# EAGLE design weather baloon_tx (EAGLE 9.2.0)
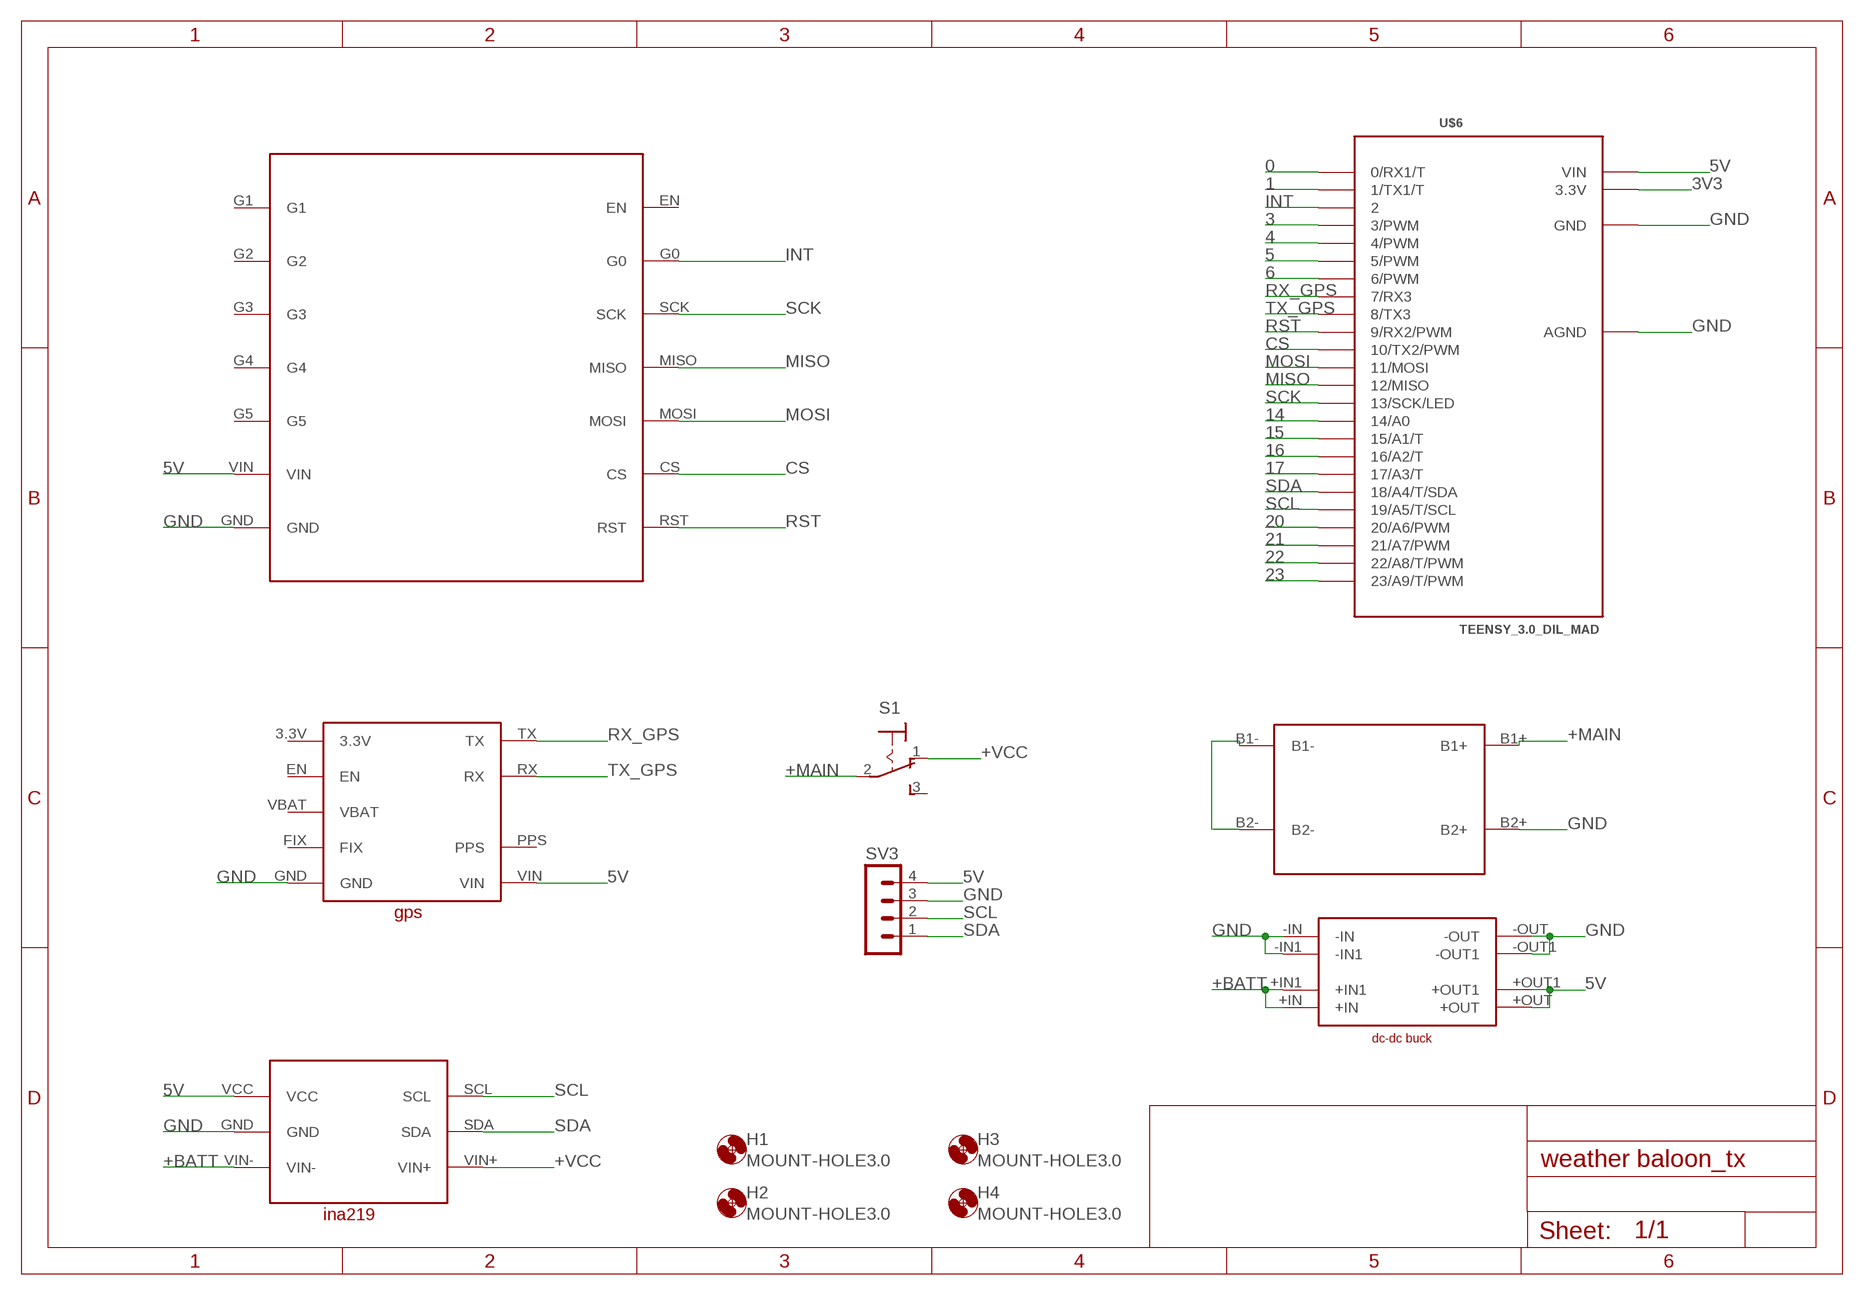
[diagram p0: schematic, sheet 1]

## Parts
H1  MOUNT-HOLE3.0  [3,0]
H2  MOUNT-HOLE3.0  [3,0]
H3  MOUNT-HOLE3.0  [3,0]
H4  MOUNT-HOLE3.0  [3,0]
S1  320-916  [320-916]
SV3  MA04-1  [MA04-1]
U$1  RFM96_MAD  [RFM96]
U$2  DC-DC_BUCK_MAD  [DC-DC_BUCK]
U$3  GPS_MAD  [GPS]
U$4  18650-2  [18650-2]
U$5  INA219_MAD  [INA219]
U$6  TEENSY_3.0_DIL_MAD  [TEENSY_3.0_DIL_MAD]

## Nets
0: U$6.0(0/RX1/T)
1: U$6.1(1/TX1/T)
3: U$6.3(3/PWM)
3V3: U$6.3.3V
4: U$6.4(4/PWM)
5: U$6.5(5/PWM)
5V: SV3.4 U$1.VIN U$2.+OUT U$2.+OUT1 U$3.VIN U$5.VCC U$6.VIN
6: U$6.6(6/PWM)
14: U$6.14/A0
15: U$6.15/A1(15/A1/T)
16: U$6.16/A2(16/A2/T)
17: U$6.17/A3(17/A3/T)
20: U$6.20/A6(20/A6/PWM)
21: U$6.21/A7(21/A7/PWM)
22: U$6.22/A8(22/A8/T/PWM)
23: U$6.23/A9(23/A9/T/PWM)
+BATT: U$2.+IN U$2.+IN1 U$5.VIN-
+MAIN: S1.2(P) U$4.B1+
+VCC: S1.1(O) U$5.VIN+
CS: U$1.CS U$6.10(10/TX2/PWM)
GND: SV3.3 U$1.GND U$2.-IN U$2.-IN1 U$2.-OUT U$2.-OUT1 U$3.GND U$4.B2+ U$5.GND U$6.AGND U$6.GND
INT: U$1.G0 U$6.2
MISO: U$1.MISO U$6.12(12/MISO)
MOSI: U$1.MOSI U$6.11(11/MOSI)
N$3: U$4.B1- U$4.B2-
RST: U$1.RST U$6.9(9/RX2/PWM)
RX_GPS: U$3.TX U$6.7(7/RX3)
SCK: U$1.SCK U$6.13(13/SCK/LED)
SCL: SV3.2 U$5.SCL U$6.19/A5(19/A5/T/SCL)
SDA: SV3.1 U$5.SDA U$6.18/A4(18/A4/T/SDA)
TX_GPS: U$3.RX U$6.8(8/TX3)
Unconnected: S1.3(S) U$1.EN U$1.G1 U$1.G2 U$1.G3 U$1.G4 U$1.G5 U$3.3.3V U$3.EN U$3.FIX U$3.PPS U$3.VBAT

## Library data of the parts
H1-H4 = holes:MOUNT-HOLE: MOUNTING HOLE with drill center marker
S1 = switch:320-916: TOGGLE SWITCH distributor RS Components
SV3 = con-lstb:MA04-1: PIN HEADER; OC_FARNELL: unknown; OC_NEWARK: unknown
U$1 = rfm95_mad:RFM96_MAD: rfm96_mad
U$2 = dc-dc_mad:DC-DC_BUCK_MAD
U$3 = gps_mad:GPS_MAD
U$4 = 18650 holder-3:18650-2
U$5 = ina219_mad:INA219_MAD
U$6 = Teensy_3_and_LC_Series_Boards_v1.4:TEENSY_3.0_DIL_MAD

## Board
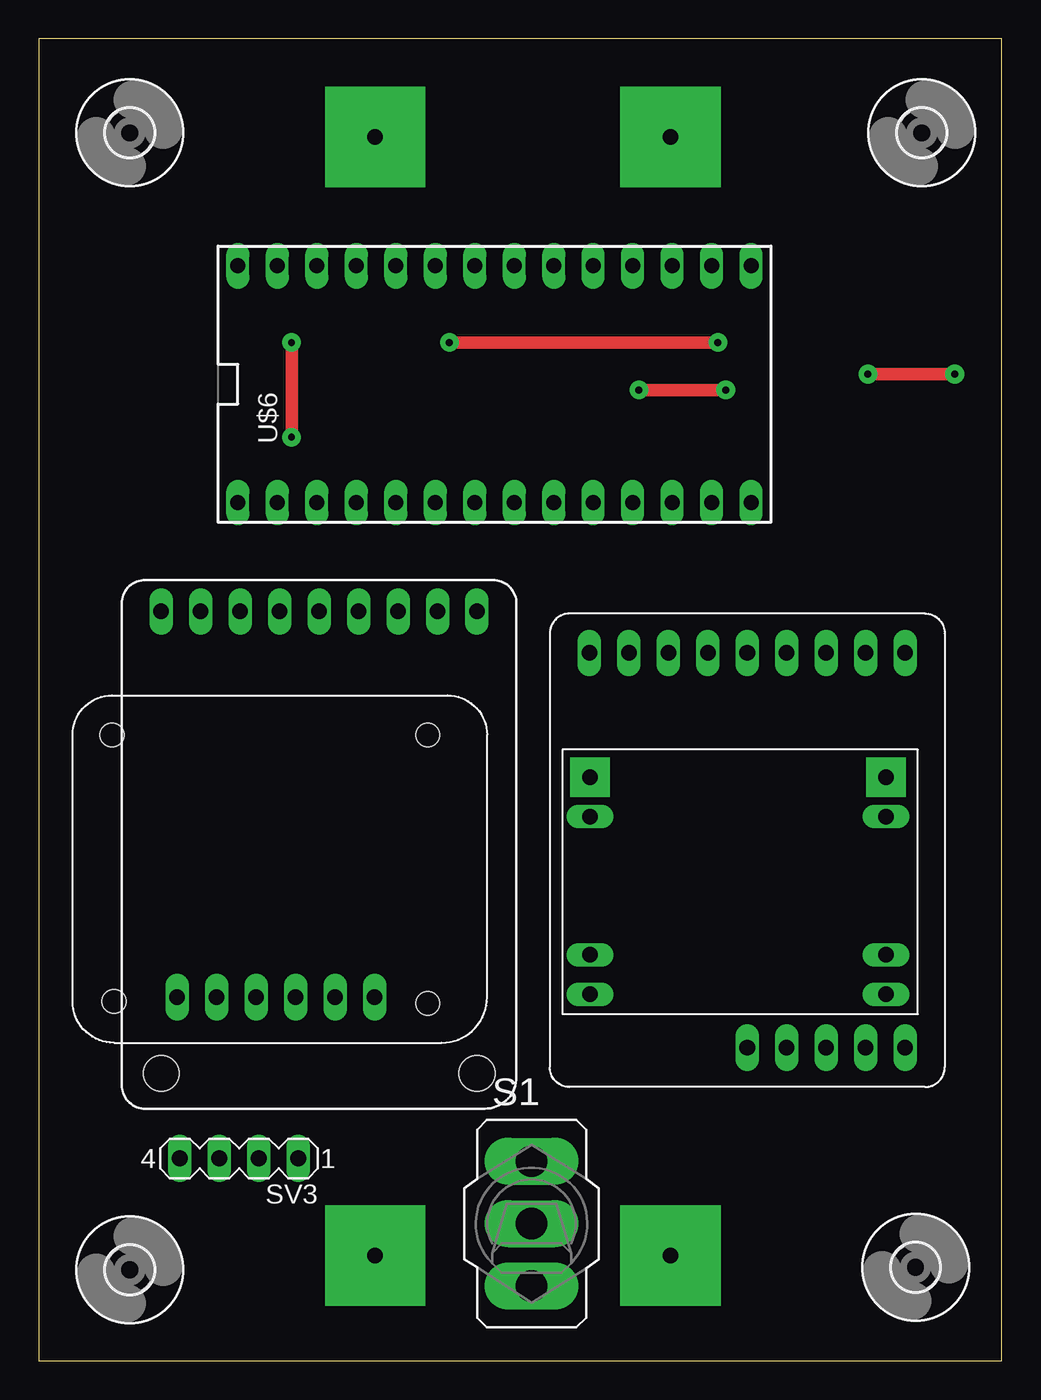
[diagram p1: board, top side]
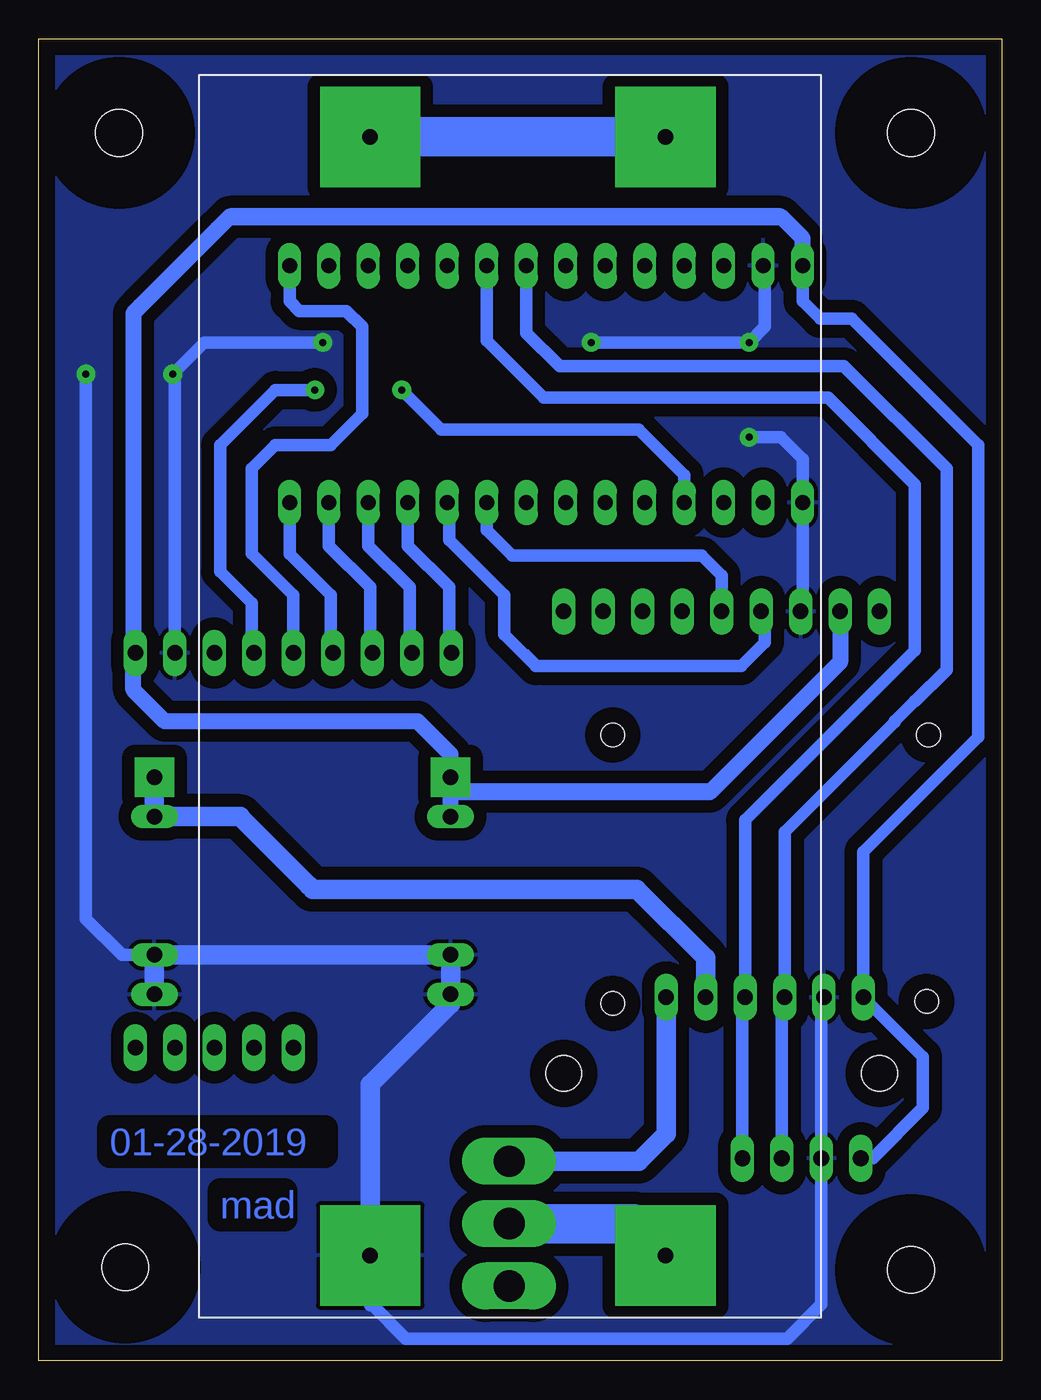
[diagram p2: board, bottom side, seen from below]

Size 61.96 x 85.08 mm. Coordinates in mm from the lower left corner, seen from the top.
Outline: 0,0 61.96,0 61.96,85.08 0,85.08 0,0
Copper layers (1*16): Top 0.035mm / dielectric 1.5mm / Bottom 0.035mm
Design rules "default": minimum track width 6mil, minimum drill 0.35mm, track to track 6mil, track to pad 6mil, pad to pad 6mil, via to via 6mil, smd to smd 6mil, copper to edge 40mil, drill to drill 6mil, minimum pad ring 10mil, minimum via ring 8mil, stop-mask expansion 4mil, vias tented up to drill 0mil, thermal gap 10mil

### Footprints (pad centres in the part's own frame; a part is rotated, then mirrored left to right if it is on the bottom)
3,0 = hole 3: 0,0
320-916 = drill 2.007 long: 1 0,4.013; 2 0,0; 3 0,-4.013
MA04-1 = drill 1.016 long: 1 -3.81,0; 2 -1.27,0; 3 1.27,0; 4 3.81,0
RFM96 = drill 1 pad 1.422 long: CS 7.62,-12.7; EN -5.08,-12.7; G0 -2.54,-12.7; G1 -10.16,12.7; G2 -7.62,12.7; G3 -5.08,12.7; G4 -2.54,12.7; G5 0,12.7; GND -7.62,-12.7; MISO 2.54,-12.7; MOSI 5.08,-12.7; RST 10.16,-12.7; SCK 0,-12.7; VIN -10.16,-12.7
DC-DC_BUCK = drill 1 pad 2.54 square: +IN 7.112,-8.89; +OUT 7.112,10.16 | drill 1 long: +IN1 4.572,-8.89; +OUT1 4.572,10.16; -IN -6.858,-8.89; -IN1 -4.318,-8.89; -OUT -6.858,10.16; -OUT1 -4.318,10.16
GPS = drill 1 pad 1.422 long: 3.3V -10.16,-15.24; EN -7.62,-15.24; FIX -2.54,-15.24; GND 5.08,-15.24; PPS 10.16,-15.24; RX 2.54,-15.24; TX 0,-15.24; VBAT -5.08,-15.24; VIN 7.62,-15.24 | hole 2.286: 10.16,14.478; -10.16,14.478
18650-2 = drill 1 pad 6.452 square: B1+ -11.46,35.05; B1- -11.46,-36.95; B2+ 7.54,35.05; B2- 7.54,-36.95
INA219 = drill 1 pad 1.422 long: GND -2.54,-7.62; SCL 0,-7.62; SDA 2.54,-7.62; VCC -5.08,-7.62; VIN+ 7.62,-7.62; VIN- 5.08,-7.62 | hole 1.524: 11.049,-8.001; -9.144,-7.874; -9.271,9.271; 11.049,9.271
TEENSY_3.0_DIL_MAD = drill 0.965 long: 0 -7.62,13.97; 1 -7.62,11.43; 2 -7.62,8.89; 3 -7.62,6.35; 3.3V 7.62,11.43; 4 -7.62,3.81; 5 -7.62,1.27; 6 -7.62,-1.27; 7 -7.62,-3.81; 8 -7.62,-6.35; 9 -7.62,-8.89; 10 -7.62,-11.43; 11 -7.62,-13.97; 12 -7.62,-16.51; 13 7.62,-16.51; 14/A0 7.62,-13.97; 15/A1 7.62,-11.43; 16/A2 7.62,-8.89; 17/A3 7.62,-6.35; 18/A4 7.62,-3.81; 19/A5 7.62,-1.27; 20/A6 7.62,1.27; 21/A7 7.62,3.81; 22/A8 7.62,6.35; 23/A9 7.62,8.89; AGND 7.62,13.97; GND -7.62,16.51; VIN 7.62,16.51

### Placement (x,y rotation side)
H1  5.84,79.03 0 top
H2  56.81,79.03 0 top
H3  56.41,6.01 0 top
H4  5.84,5.84 0 top
S1  31.7,8.82 0 top
SV3  12.88,13.02 180 top
U$1  45.58,32.85 180 top
U$2  45.63,30.44 90 top
U$3  18.03,32.98 180 top
U$4  33.1,41.82 180 bottom
U$5  13.98,31 0 top
U$6  29.32,62.85 90 top

### Tracks (layer width: path | path; a pad name or v marks a point on that pad's centre or on a via)
5V
  Bottom 0.152: 35.47,36.58 35.47,37.08 | 35.47,37.08 U$2.+OUT | U$1.VIN 55.74,45.72 55.74,67.56 55.74,68.21 50.8,73.15 13.72,73.15 12.7,72.14 12.7,70.36 | 12.7,70.1 12.7,70.36 | 12.7,70.36 U$6.VIN | U$3.VIN 10.41,45.47 18.8,37.08 35.47,37.08
  Bottom 0.813: 35.47,37.59 35.47,39.03 | U$1.VIN 55.88,45.41 55.88,43.18 | SV3.4 8.32,13.02 5.08,16.26 5.08,19.56 U$5.VCC 8.9,32.76 1.52,40.13 1.52,58.93 9.65,67.06 11.68,67.06 12.81,68.18 U$6.VIN
  Bottom 1.016: U$2.+OUT1 35.47,36.58 | 35.47,36.58 35.47,37.59 | U$3.VIN 10.41,44.96 18.8,36.58 35.47,36.58 | U$2.+OUT 35.47,39.03 37.59,41.15 53.85,41.15 55.88,43.18 55.88,45.58 | 55.88,45.58 55.74,45.72 | U$6.VIN 12.81,72.25 14.22,73.66 49.64,73.66 55.74,67.56 55.88,67.42 55.88,45.58
+BATT
  Bottom 0.152: 49,35 54.36,35 | 54.36,35 54.51,35 U$2.+IN1 | 44.34,30.34 44.59,30.59 | U$2.+IN 54.36,37.39 54.36,35
  Bottom 1.27: U$5.VIN- 19.06,25.91 23.49,30.34 44.34,30.34 | 44.59,30.59 49,35 49.01,35.01 U$2.+IN1 U$2.+IN
+MAIN
  Bottom 2.54: S1.2 23.69,8.82 U$4.B1+
+VCC
  Bottom 1.27: U$5.VIN+ 21.6,14.6 23.37,12.83 S1.1
CS
  Bottom 0.813: U$6.10 40.75,52.43 38.1,49.78 38.1,45.69 U$1.CS
GND  (via drill 0.45 pad 1.2)
  Top 0.813: v16.26,59.44 v16.26,65.53 | v53.34,63.5 v58.93,63.5 | v43.69,65.53 v26.42,65.53
  Bottom 0.152: U$3.GND 12.81,48.36 | U$4.B2+ 40.64,3.56 38.18,1.09 14.73,1.09 | 11.61,3.63 11.61,12.19 11.61,12.7 | 11.61,12.7 SV3.3 | U$5.GND 11.44,12.87 11.61,12.7 | 12.7,56.9 12.7,54.97 12.81,54.86
  Bottom 0.813: 12.81,48.36 12.81,54.86 U$6.GND 12.81,58.02 14.22,59.44 v16.26,59.44 | U$6.AGND 15.24,70.36 15.24,66.55 v16.26,65.53 v26.42,65.53 | U$5.GND 11.61,23.21 11.61,12.19 | SV3.3 11.61,3.63 13.82,1.42 38.35,1.42 40.49,3.56 40.64,3.56 | U$4.B2+ 40.64,7.11 | U$1.GND 53.2,63.36 v53.34,63.5 51.31,65.53 v43.69,65.53 | v58.93,63.5 58.93,28.45 56.6,26.12 U$2.-IN1
  Bottom 1.27: U$2.-IN U$2.-IN1 U$2.-OUT1 U$2.-OUT 35.47,22.95 40.64,17.78 40.64,7.11
  pour Bottom (isolate 0.813): 0.51,84.33 61.47,84.33 61.47,0.51 0.51,0.51
INT  (via drill 0.45 pad 1.2)
  Top 0.813: v44.2,62.48 v38.61,62.48
  Bottom 0.813: U$6.2 20.43,57.01 23.37,59.94 36.07,59.94 v38.61,62.48 | v44.2,62.48 46.74,62.48 50.29,58.93 50.29,50.8 48.26,48.77 48.26,45.69 U$1.G0
MISO
  Bottom 0.152: 43.18,49.28 43.18,45.41 | 43.18,45.21 43.18,45.41 | 43.18,45.41 U$1.MISO
  Bottom 0.813: U$6.12 45.83,51.93 43.18,49.28 43.18,45.21
MOSI
  Bottom 0.813: U$6.11 43.29,52.43 40.64,49.78 40.64,45.69 U$1.MOSI
N$3
  Bottom 2.54: U$4.B1- U$4.B2-
RST
  Bottom 0.813: U$6.9 38.21,52.43 35.56,49.78 35.56,45.69 U$1.RST
RX_GPS
  Bottom 0.813: U$3.TX 18.03,50.54 19.3,51.82 31.5,51.82 33.13,53.45 U$6.7
SCK
  Bottom 0.813: U$1.SCK 45.58,49.28 48.26,51.96 48.26,57.4 46.74,58.93 43.18,58.93 41.15,60.96 41.15,66.55 42.16,67.56 45.21,67.56 45.83,68.18 U$6.13
SCL
  Bottom 0.813: U$6.19/A5 30.59,66.15 28.45,64.01 10.16,64.01 3.56,57.4 3.56,44.46 5.56,42.46 5.61,42.46 6.89,41.18 6.89,41.12 13.98,34.04 U$5.SCL 14.15,23.21 SV3.2
SDA
  Bottom 0.152: 16.69,13.21 SV3.1
  Bottom 0.813: U$6.18/A4 33.13,65.64 29.46,61.98 11.18,61.98 5.59,56.39 5.59,45.72 16.52,34.79 U$5.SDA 16.69,23.21 16.69,13.21
TX_GPS
  Bottom 0.152: 35.56,52.83 33.02,50.29 | 30.48,45.72 29.46,44.7
  Bottom 0.813: U$6.8 35.56,55.12 35.56,52.83 32,49.28 32,46.74 29.97,44.7 29.46,44.7 16.76,44.7 15.24,46.23 15.24,47.97 U$3.RX

### Text on the board
Bottom: 01-28-2019 | mad